# Altium schematic sheet Sheet1.SchDoc
size A4
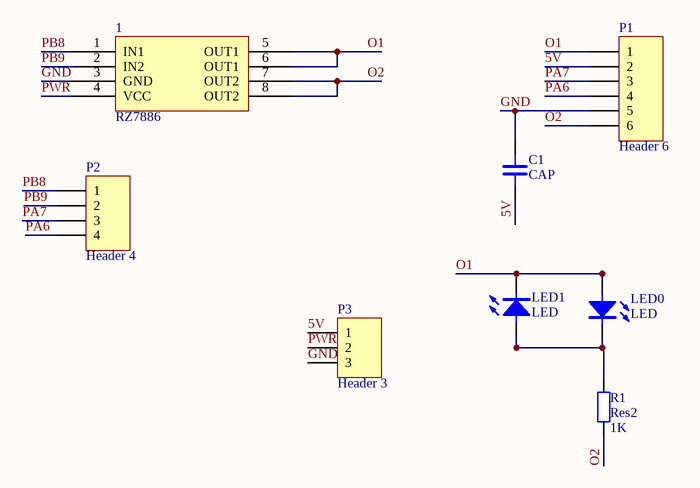
[diagram p0: Sheet1.SchDoc]

## Parts
1  RZ7886  [RZ7886 - duplicate]
C1  CAP  [0805]
LED0  LED  [LED-0805]
LED1  LED  [LED-0805]
P1  Header 6  [HDR1X6]
P2  Header 4  [HDR1X4]
P3  Header 3  [HDR1X3]
R1  Res2  value 1K  [AXIAL-0.4]

## Nets
5V: C1.1 P1.2 P3.1
GND: 1.3(GND) C1.2 P1.5 P3.3
O1: 1.5(OUT1) 1.6(OUT1) LED0.1(A) LED1.2(C) P1.1
O2: 1.7(OUT2) 1.8(OUT2) P1.6 R1.1
PA6: P1.4 P2.4
PA7: P1.3 P2.3
PB8: 1.1(IN1) P2.1
PB9: 1.2(IN2) P2.2
PWR: 1.4(VCC) P3.2
NetLED0_2: LED0.2(C) LED1.1(A) R1.2

## Library data of the parts
C1 = CAP: Capacitor
P1 = Header 6: Header, 6-Pin; LatestRevisionDate: 17-Jul-2002; LatestRevisionNote: Re-released for DXP Platform.; Publisher: Altium Limited
P2 = Header 4: Header, 4-Pin; LatestRevisionDate: 17-Jul-2002; LatestRevisionNote: Re-released for DXP Platform.; Publisher: Altium Limited
P3 = Header 3: Header, 3-Pin; LatestRevisionDate: 17-Jul-2002; LatestRevisionNote: Re-released for DXP Platform.; Publisher: Altium Limited
R1 = Res2: Resistor; Published: 8-Jun-2000; LatestRevisionDate: 17-Jul-2002; LatestRevisionNote: Re-released for DXP Platform.; PackageReference: AXIAL-0.4; Publisher: Altium Limited; PackageDescription: Axial Device, Thru-Hole; 2 Leads; 0.4 in Pin Spacing